# EasyEDA schematic gigatron-expansion-v5.json
TITLE: Gigatron expansion (compact version); REV: 1.0; Date: 2021-02-23; Sheet: 1/1; Drawn By: lb3361; Company: lb3361
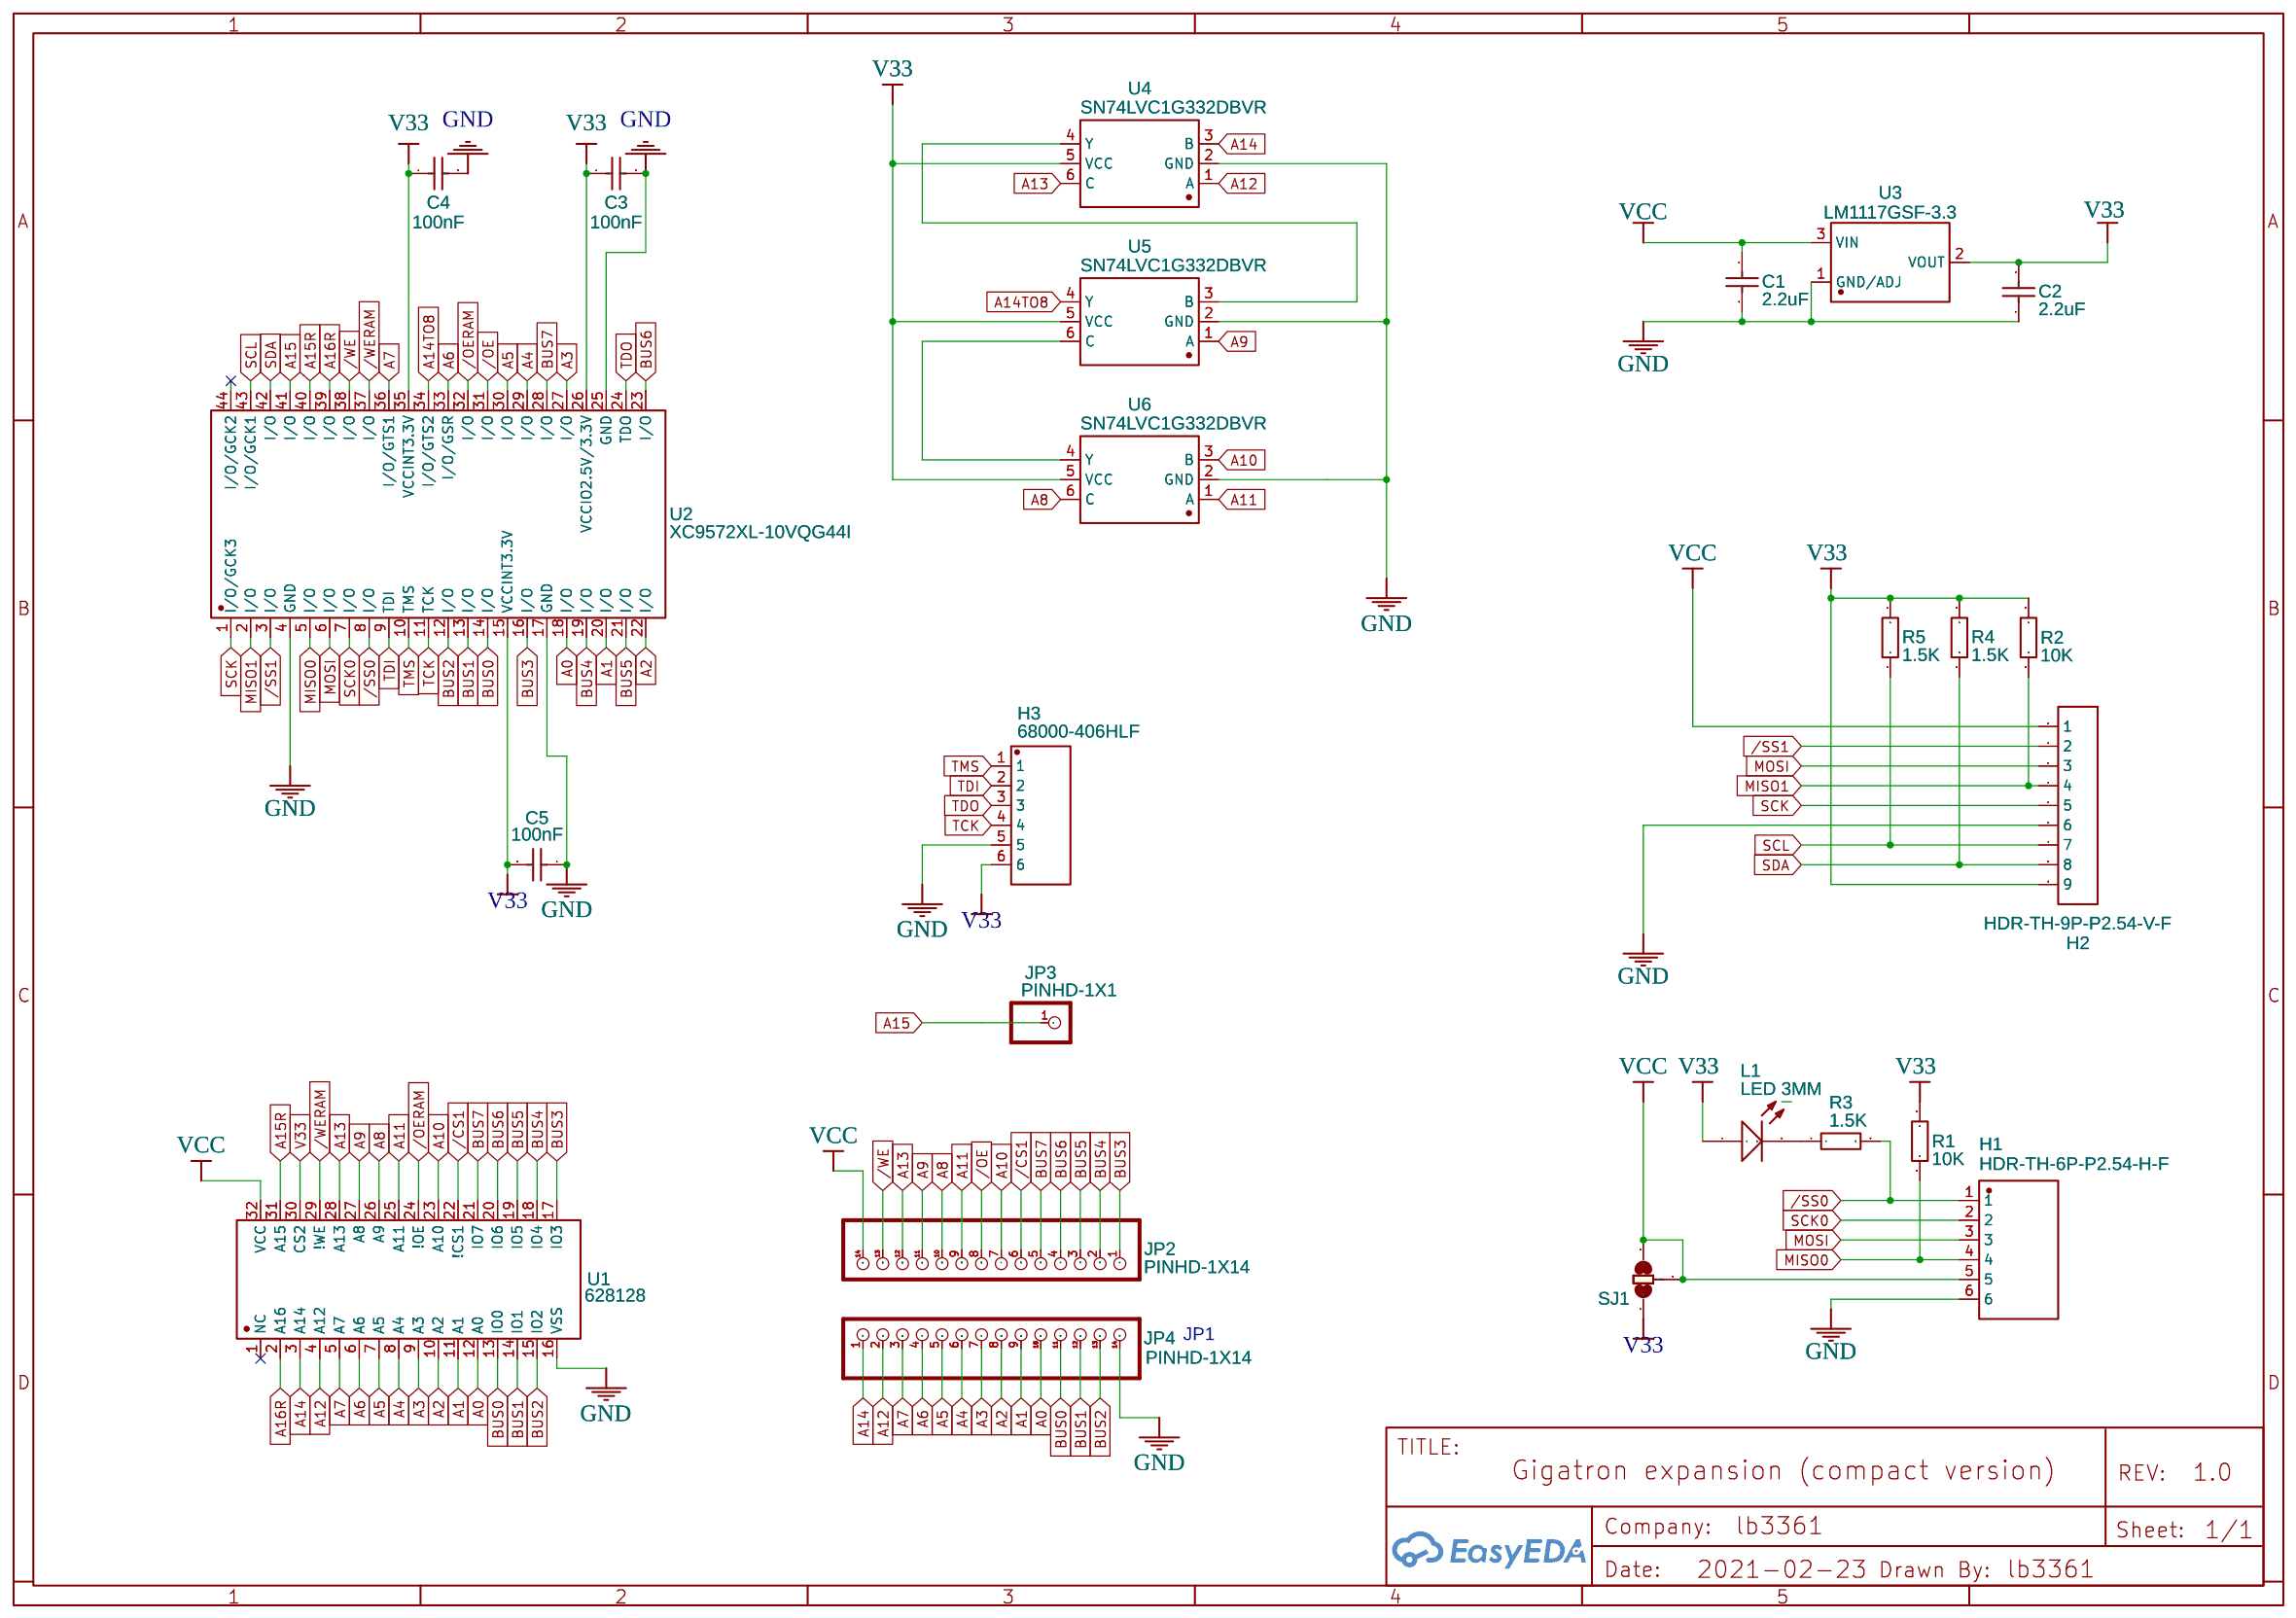
[diagram p0: schematic sheet]

## Parts
C1  2.2uF  [C0805]
C2  2.2uF  [C0805]
C3  100nF  [C0402]
C4  100nF  [C0402]
C5  100nF  [C0402]
H1  HDR-TH-6P-P2.54-H-F  [A2541HWR-6P]
H2  HDR-TH-9P-P2.54-V-F  [HDR-TH_9P-P2.54-V]
H3  68000-406HLF  [HDR-TH_6P-P2.54-V]
JP2  PINHD-1X14  [1X14-CB]
JP3  PINHD-1X1  [1X01]
JP4  PINHD-1X14  [1X14-CB]
L1  LED 3MM  [LED-TH_BD3.2-P2.54-FD]
R1  10K  [R0402]
R2  10K  [R0402]
R3  1.5K  [R0402]
R4  1.5K  [R0402]
R5  1.5K  [R0402]
SJ1  SOLDERJUMPER_2WAYT  [SJ_2]
U1  628128  [DIP-32_L40.9-W17.8-P2.54-LS17.8-BL]
U2  XC9572XL-10VQG44I  [QFP-44_L10.0-W10.0-P0.80-LS12.0-BL]
U3  LM1117GSF-3.3  [SOT-23-3_L2.9-W1.6-P1.90-LS2.8-BR-CW]
U4  SN74LVC1G332DBVR  [SOT-23-6_L2.9-W1.6-P0.95-LS2.8-BR]
U5  SN74LVC1G332DBVR  [SOT-23-6_L2.9-W1.6-P0.95-LS2.8-BR]
U6  SN74LVC1G332DBVR  [SOT-23-6_L2.9-W1.6-P0.95-LS2.8-BR]

## Library data of the parts
C1 C2 = 0805F225M500NT: Supplier: LCSC; Manufacturer: FH; Supplier Part: C49217; SMT Type: Basic; JLCPCB SMD: Yes; LCSC Assembly: Yes; Assembly Type: smtWeld; Paste Type: base
C3-C5 = CL05B104KO5NNNC: Supplier: LCSC; Manufacturer: SAMSUNG; Supplier Part: C1525; SMT Type: Basic; JLCPCB SMD: Yes; LCSC Assembly: Yes
H1 = A2541HWR-6P: Supplier: LCSC; Supplier Part: C225514; Manufacturer: Changjiang Connectors; Contributor: LCSC; LCSC Assembly: Yes; SMT Type: Extend
H2 = Header-Female-2.54_1x9: Supplier: LCSC; Manufacturer: BOOMELE; Manufacturer Part: 2.54mm 1*9 Straight Female header; image: //image.lceda.cn/szlcsc/C39576.jpg; Supplier Part: C39576; LCSC Assembly: Yes; SMT Type: Extend
H3 = 68000-406HLF: Supplier: LCSC; Supplier Part: C178289; Manufacturer: Amphenol ICC; Contributor: LCSC
JP2 JP4 = PINHD-1X14: Contributor: Adafruit
JP3 = PINHD-1X1: Contributor: Adafruit
L1 = TSAL4400: Supplier: LCSC; Manufacturer: VISHAY; Contributor: LCSC; Supplier Part: C94135; LCSC Assembly: Yes; SMT Type: Extend
R1 R2 = 0402WGF1002TCE: Supplier: LCSC; Manufacturer: UniOhm; Supplier Part: C25744; SMT Type: Basic; JLCPCB SMD: Yes; LCSC Assembly: Yes
R3-R5 = 0402WGF1501TCE: Supplier: LCSC; Manufacturer: UniOhm; Supplier Part: C25867; SMT Type: Basic; JLCPCB SMD: Yes; LCSC Assembly: Yes
SJ1 = SOLDERJUMPER_2WAYT: Solder Jumper; Contributor: SparkFun
U1 = 628128P
U2 = XC9572XL-10VQG44I: Supplier: LCSC; Supplier Part: C96598; Manufacturer: XILINX(赛灵思); Paste Type: expand; Assembly Type: smtWeld; Contributor: LCSC
U3 = LM1117GSF-3.3: Supplier: LCSC; Supplier Part: C481677; Manufacturer: HTC Korea TAEJIN Tech; Contributor: LCSC
U4-U6 = SN74LVC1G332DBVR: Supplier: LCSC; Manufacturer: TI; image: //image.lceda.cn/szlcsc/C43368.jpg; Supplier Part: C43368; SMT Type: Extend; JLCPCB SMD: Yes; LCSC Assembly: Yes

## Nets
GND: C1.2 C2.2 C3.2 C4.2 C5.1 H1.6 H2.6 H3.5 JP4.14 U1.16(VSS) U2.4(GND) U2.17(GND) U2.25(GND) U3.1(GND/ADJ) U4.2(GND) U5.2(GND) U6.2(GND)
V33: C2.1 C3.1 C4.1 C5.2 H2.9 H3.6 L1.1(A) R1.2 R2.2 R4.2 R5.2 SJ1.1 U1.30(CS2) U2.15(VCCINT3.3V) U2.26(VCCIO2.5V/3.3V) U2.35(VCCINT3.3V) U3.2(VOUT) U4.5(VCC) U5.5(VCC) U6.5(VCC)
VCC: C1.1 H1.5 H2.1 JP2.14 SJ1.2 SJ1.3 U1.32(VCC) U3.3(VIN)
/CS1: JP2.6 U1.22(!CS1)
/OE: JP2.8 U2.31(I/O)
/OERAM: U1.24(!OE) U2.32(I/O)
/SS0: H1.1 R3.2 U2.8(I/O)
/SS1: H2.2 U2.3(I/O)
/WE: JP2.13 U2.38(I/O)
/WERAM: U1.29(!WE) U2.37(I/O)
A0: JP4.10 U1.12(A0) U2.18(I/O)
A1: JP4.9 U1.11(A1) U2.20(I/O)
A2: JP4.8 U1.10(A2) U2.22(I/O)
A3: JP4.7 U1.9(A3) U2.27(I/O)
A4: JP4.6 U1.8(A4) U2.29(I/O)
A5: JP4.5 U1.7(A5) U2.30(I/O)
A6: JP4.4 U1.6(A6) U2.33(I/O/GSR)
A7: JP4.3 U1.5(A7) U2.36(I/O/GTS1)
A8: JP2.10 U1.26(A9) U6.6(C)
A9: JP2.11 U1.27(A8) U5.1(A)
A10: JP2.7 U1.23(A10) U6.3(B)
A11: JP2.9 U1.25(A11) U6.1(A)
A12: JP4.2 U1.4(A12) U4.1(A)
A13: JP2.12 U1.28(A13) U4.6(C)
A14: JP4.1 U1.3(A14) U4.3(B)
A14TO8: U2.34(I/O/GTS2) U5.4(Y)
A15: JP3.1 U2.41(I/O)
A15R: U1.31(A15) U2.40(I/O)
A16R: U1.2(A16) U2.39(I/O)
BUS0: JP4.11 U1.13(IO0) U2.14(I/O)
BUS1: JP4.12 U1.14(IO1) U2.13(I/O)
BUS2: JP4.13 U1.15(IO2) U2.12(I/O)
BUS3: JP2.1 U1.17(IO3) U2.16(I/O)
BUS4: JP2.2 U1.18(IO4) U2.19(I/O)
BUS5: JP2.3 U1.19(IO5) U2.21(I/O)
BUS6: JP2.4 U1.20(IO6) U2.23(I/O)
BUS7: JP2.5 U1.21(IO7) U2.28(I/O)
MISO0: H1.4 R1.1 U2.5(I/O)
MISO1: H2.4 R2.1 U2.2(I/O)
MOSI: H1.3 H2.3 U2.6(I/O)
SCK: H2.5 U2.1(I/O/GCK3)
SCK0: H1.2 U2.7(I/O)
SCL: H2.7 R5.1 U2.43(I/O/GCK1)
SDA: H2.8 R4.1 U2.42(I/O)
TCK: H3.4 U2.11(TCK)
TDI: H3.2 U2.9(TDI)
TDO: H3.3 U2.24(TDO)
TMS: H3.1 U2.10(TMS)
Net-(L1-2): L1.2(C) R3.1
Net-(U4-4): U4.4(Y) U5.3(B)
Net-(U5-6): U5.6(C) U6.4(Y)

Not connected (* = marked no-connect by the designer): U1 1(NC)*; U2 44(I/O/GCK2)

## Notes on the sheet
- JP1
